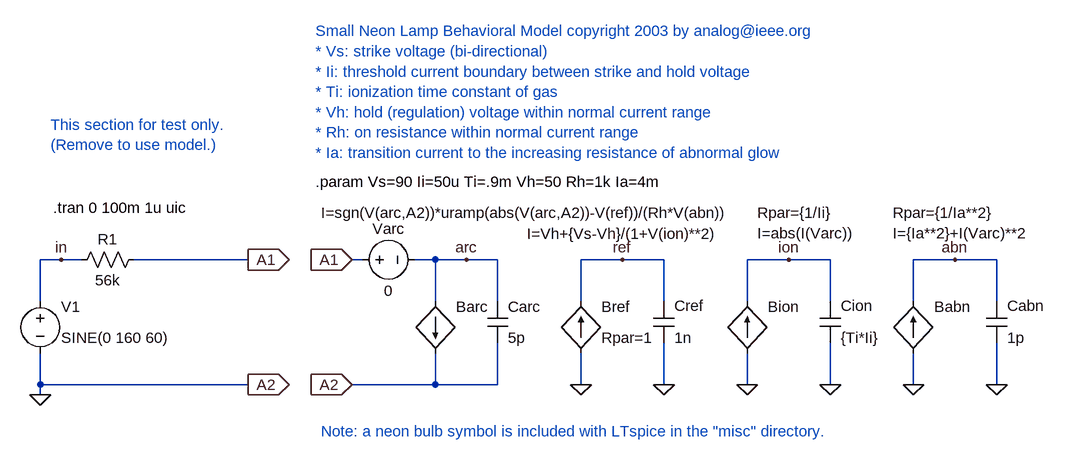
[diagram p0: schematic Neon bulb.asc]
Neon bulb.asc, the LTspice schematic file:
Version 4
SHEET 1 1832 696
WIRE -80 304 -80 240
WIRE -80 240 -48 240
WIRE 64 240 240 240
WIRE 624 240 624 304
WIRE -80 448 -80 432
WIRE 624 368 624 432
WIRE 624 432 528 432
WIRE -80 432 -80 384
WIRE 528 304 528 240
WIRE 528 240 576 240
WIRE -48 240 -16 240
WIRE 576 240 624 240
WIRE 496 240 528 240
WIRE 880 432 880 368
WIRE 880 304 880 240
WIRE 880 240 816 240
WIRE 816 240 752 240
WIRE 752 240 752 304
WIRE 752 384 752 432
WIRE 1008 384 1008 432
WIRE 1136 432 1136 368
WIRE 1136 240 1072 240
WIRE 1136 304 1136 240
WIRE 416 240 400 240
WIRE 528 432 400 432
WIRE -80 432 240 432
WIRE 528 384 528 432
WIRE 1072 240 1008 240
WIRE 1008 240 1008 304
WIRE 1392 432 1392 368
WIRE 1392 304 1392 240
WIRE 1392 240 1328 240
WIRE 1328 240 1264 240
WIRE 1264 240 1264 304
WIRE 1264 384 1264 432
FLAG -80 448 0
FLAG -48 240 in
FLAG 576 240 arc
FLAG 816 240 ref
FLAG 1008 432 0
FLAG 1136 432 0
FLAG 1072 240 ion
FLAG 400 240 A1
IOPIN 400 240 In
FLAG 400 432 A2
IOPIN 400 432 In
FLAG 240 240 A1
IOPIN 240 240 Out
FLAG 240 432 A2
IOPIN 240 432 Out
FLAG 752 432 0
FLAG 880 432 0
FLAG 1328 240 abn
FLAG 1264 432 0
FLAG 1392 432 0
SYMBOL bi 528 304 R0
WINDOW 3 -176 -136 Left 0
WINDOW 123 24 -28 Left 0
WINDOW 0 32 8 Left 0
SYMATTR Value I=sgn(V(arc,A2))*uramp(abs(V(arc,A2))-V(ref))/(Rh*V(abn))
SYMATTR InstName Barc
SYMBOL voltage -80 288 R0
WINDOW 0 32 24 Left 0
WINDOW 3 32 72 Left 0
SYMATTR InstName V1
SYMATTR Value SINE(0 160 60)
SYMBOL res 80 224 R90
WINDOW 0 0 56 VBottom 0
WINDOW 3 32 56 VTop 0
SYMATTR InstName R1
SYMATTR Value 56k
SYMBOL voltage 400 240 R270
WINDOW 0 32 56 VTop 0
WINDOW 3 -32 56 VBottom 0
SYMATTR InstName Varc
SYMATTR Value 0
SYMBOL bi 752 384 M180
WINDOW 0 32 72 Left 0
WINDOW 3 64 184 Center 0
WINDOW 123 32 24 Left 0
SYMATTR InstName Bref
SYMATTR Value I=Vh+{Vs-Vh}/(1+V(ion)**2)
SYMATTR Value2 Rpar=1
SYMBOL bi 1008 384 M180
WINDOW 0 32 72 Left 0
WINDOW 3 16 185 Left 0
WINDOW 123 16 216 Left 0
SYMATTR InstName Bion
SYMATTR Value I=abs(I(Varc))
SYMATTR Value2 Rpar={1/Ii}
SYMBOL cap 1120 304 R0
WINDOW 0 32 7 Left 0
WINDOW 3 32 56 Left 0
SYMATTR InstName Cion
SYMATTR Value {Ti*Ii}
SYMBOL cap 608 304 R0
WINDOW 0 32 8 Left 0
WINDOW 3 32 56 Left 0
SYMATTR InstName Carc
SYMATTR Value 5p
SYMBOL cap 864 304 R0
WINDOW 0 32 7 Left 0
WINDOW 3 32 56 Left 0
SYMATTR InstName Cref
SYMATTR Value 1n
SYMBOL bi 1264 384 M180
WINDOW 0 32 72 Left 0
WINDOW 3 -32 185 Left 0
WINDOW 123 -32 216 Left 0
SYMATTR InstName Babn
SYMATTR Value I={Ia**2}+I(Varc)**2
SYMATTR Value2 Rpar={1/Ia**2}
SYMBOL cap 1376 304 R0
WINDOW 0 32 7 Left 0
WINDOW 3 32 56 Left 0
SYMATTR InstName Cabn
SYMATTR Value 1p
TEXT -60 160 Left 0 !.tran 0 100m 1u uic
TEXT 344 120 Left 0 !.param Vs=90 Ii=50u Ti=.9m Vh=50 Rh=1k Ia=4m
TEXT 344 -112 Left 0 ;Small Neon Lamp Behavioral Model copyright 2003 by analog@ieee.org\n* Vs: strike voltage (bi-directional)\n* Ii: threshold current boundary between strike and hold voltage\n* Ti: ionization time constant of gas\n* Vh: hold (regulation) voltage within normal current range\n* Rh: on resistance within normal current range\n* Ia: transition current to the increasing resistance of abnormal glow
TEXT -64 32 Left 0 ;This section for test only.\n(Remove to use model.)
TEXT 352 504 Left 0 ;Note: a neon bulb symbol is included with LTspice in the "misc" directory.

The netlist it stands for:
* Neon bulb.asc
Barc arc 0 I=sgn(V(arc,A2))*uramp(abs(V(arc,A2))-V(ref))/(Rh*V(abn))
V1 in 0 SINE(0 160 60)
R1 A1 in 56k
Varc A1 arc 0
Bref 0 ref I=Vh+{Vs-Vh}/(1+V(ion)**2) Rpar=1
Bion 0 ion I=abs(I(Varc)) Rpar={1/Ii}
Cion ion 0 {Ti*Ii}
Carc arc 0 5p
Cref ref 0 1n
Babn 0 abn I={Ia**2}+I(Varc)**2 Rpar={1/Ia**2}
Cabn abn 0 1p
.tran 0 100m 1u uic
.param Vs=90 Ii=50u Ti=.9m Vh=50 Rh=1k Ia=4m
* Small Neon Lamp Behavioral Model copyright 2003 by analog@ieee.org
* * Vs: strike voltage (bi-directional)
* * Ii: threshold current boundary between strike and hold voltage
* * Ti: ionization time constant of gas
* * Vh: hold (regulation) voltage within normal current range
* * Rh: on resistance within normal current range
* * Ia: transition current to the increasing resistance of abnormal glow
* This section for test only.
* (Remove to use model.)
* Note: a neon bulb symbol is included with LTspice in the "misc" directory.
.backanno
.end